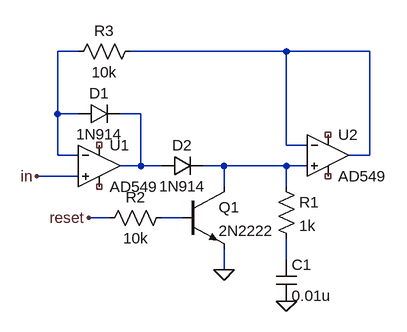
[diagram p0: schematic PeakHold.asc]
PeakHold.asc, the LTspice schematic file:
Version 4
SHEET 1 880 680
WIRE 96 -16 64 -16
WIRE 416 -16 176 -16
WIRE 544 -16 416 -16
WIRE 64 80 64 -16
WIRE 96 80 64 80
WIRE 192 80 160 80
WIRE 416 128 416 -16
WIRE 448 128 416 128
WIRE 64 144 64 80
WIRE 96 144 64 144
WIRE 544 144 544 -16
WIRE 544 144 512 144
WIRE 192 160 192 80
WIRE 192 160 160 160
WIRE 224 160 192 160
WIRE 320 160 288 160
WIRE 416 160 320 160
WIRE 448 160 416 160
WIRE 96 176 32 176
WIRE 320 192 320 160
WIRE 416 192 416 160
WIRE 144 240 112 240
WIRE 256 240 224 240
WIRE 416 304 416 272
WIRE 320 320 320 288
FLAG 320 320 0
FLAG 416 368 0
FLAG 32 176 in
FLAG 112 240 reset
SYMBOL Opamps\\AD549 128 96 R0
SYMATTR InstName U1
SYMBOL Opamps\\AD549 480 80 R0
SYMATTR InstName U2
SYMBOL diode 96 96 R270
WINDOW 0 32 32 VTop 2
WINDOW 3 0 32 VBottom 2
SYMATTR InstName D1
SYMATTR Value 1N914
SYMBOL diode 224 176 R270
WINDOW 0 32 32 VTop 2
WINDOW 3 0 32 VBottom 2
SYMATTR InstName D2
SYMATTR Value 1N914
SYMBOL res 400 176 R0
SYMATTR InstName R1
SYMATTR Value 1k
SYMBOL res 240 224 R90
WINDOW 0 0 56 VBottom 2
WINDOW 3 32 56 VTop 2
SYMATTR InstName R2
SYMATTR Value 10k
SYMBOL res 192 -32 R90
WINDOW 0 0 56 VBottom 2
WINDOW 3 32 56 VTop 2
SYMATTR InstName R3
SYMATTR Value 10k
SYMBOL cap 400 304 R0
SYMATTR InstName C1
SYMATTR Value 0.01u
SYMBOL npn 256 192 R0
SYMATTR InstName Q1
SYMATTR Value 2N2222

The netlist it stands for:
* PeakHold.asc
XU1 in N001 NC_01 NC_02 N003 AD549  ; pins In+ In- V+ V- OUT
XU2 N004 N002 NC_03 NC_04 N002 AD549  ; pins In+ In- V+ V- OUT
D1 N001 N003 1N914
D2 N003 N004 1N914
R1 N004 N006 1k
R2 N005 reset 10k
R3 N002 N001 10k
C1 N006 0 0.01u
Q1 N004 N005 0 0 2N2222
.model D D
.lib standard.dio
.model NPN NPN
.model PNP PNP
.lib standard.bjt
.backanno
.end